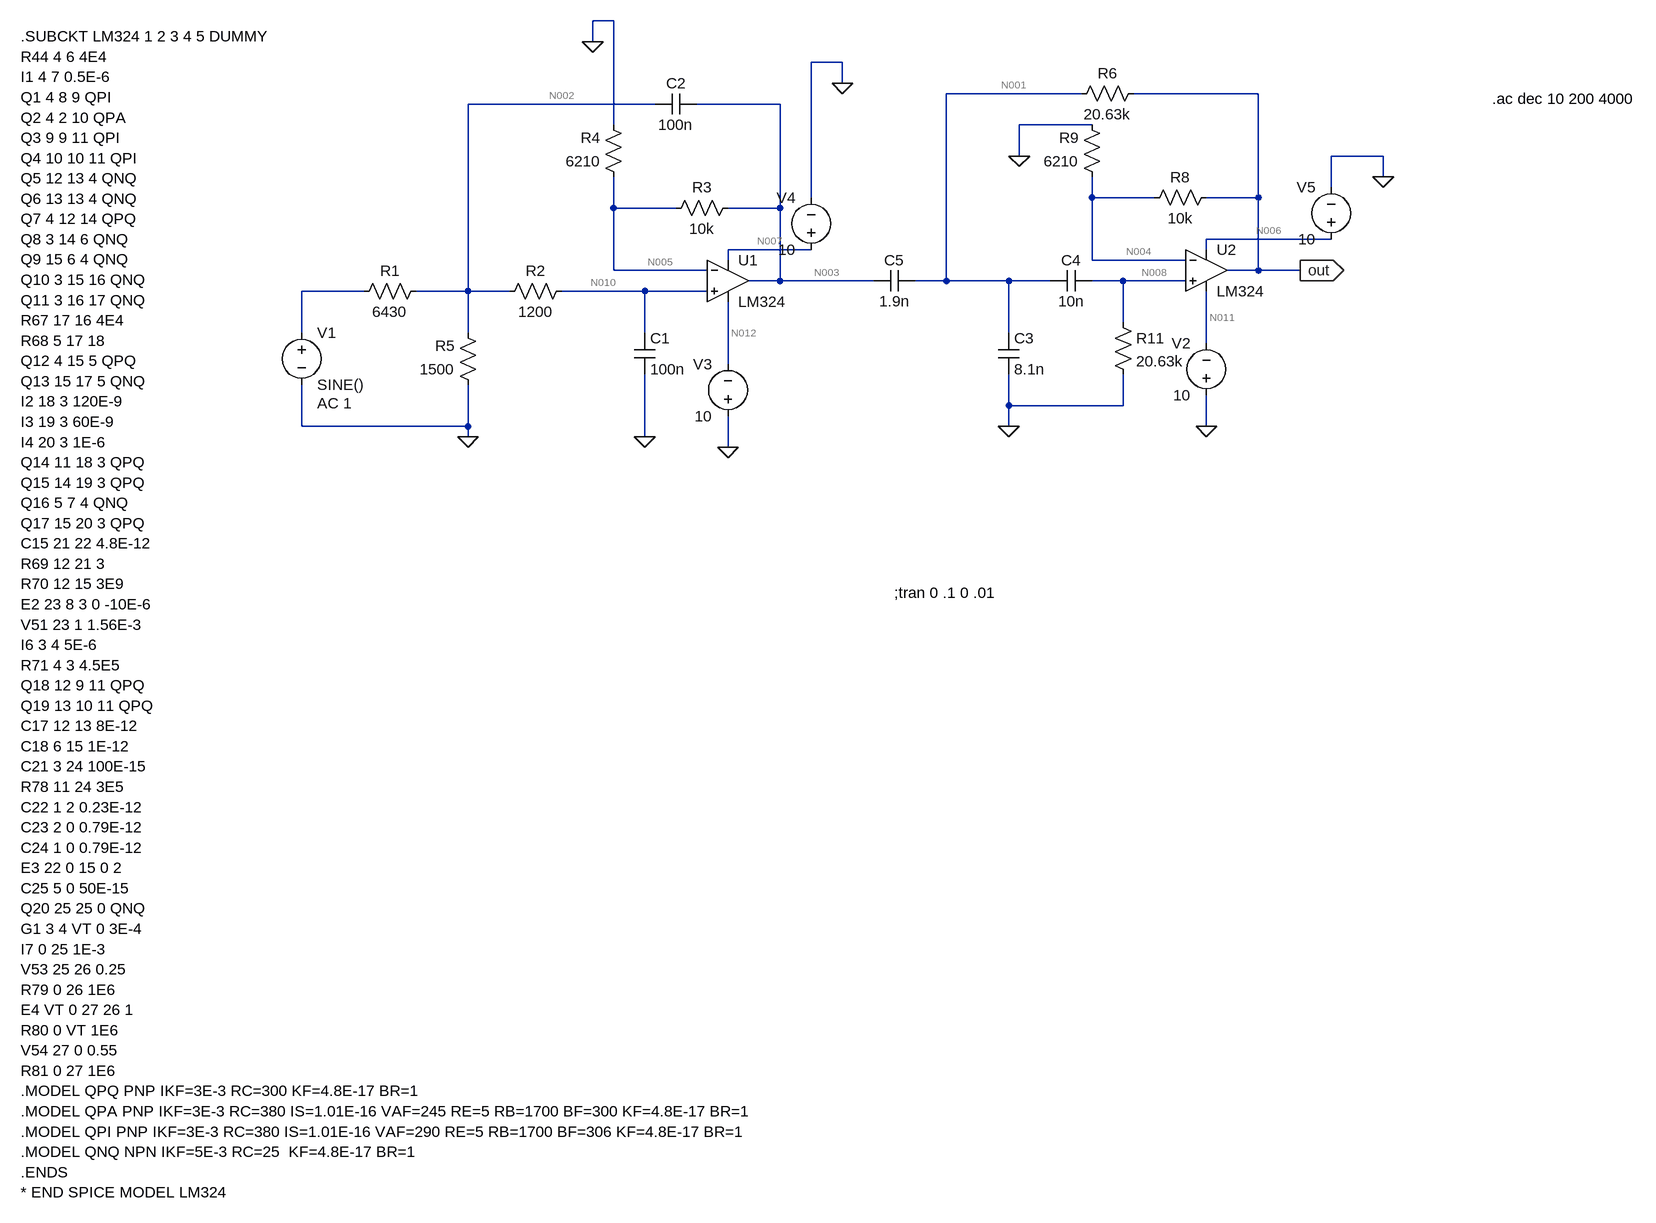
[diagram p0: schematic Draft2.asc]
Draft2.asc, the LTspice schematic file:
Version 4
SHEET 1 1476 1428
WIRE -112 -208 -144 -208
WIRE -144 -176 -144 -208
WIRE 240 -144 192 -144
WIRE 240 -112 240 -144
WIRE 608 -96 400 -96
WIRE 880 -96 688 -96
WIRE -48 -80 -336 -80
WIRE 144 -80 16 -80
WIRE -112 -48 -112 -208
WIRE 624 -48 512 -48
WIRE 512 0 512 -48
WIRE 1072 0 992 0
WIRE 1072 32 1072 0
WIRE 992 48 992 0
WIRE 192 64 192 -144
WIRE 624 64 624 32
WIRE 720 64 624 64
WIRE 880 64 880 -96
WIRE 880 64 800 64
WIRE -112 80 -112 32
WIRE -16 80 -112 80
WIRE 144 80 144 -80
WIRE 144 80 64 80
WIRE 992 128 800 128
WIRE 192 144 64 144
WIRE 800 144 800 128
WIRE 64 160 64 144
WIRE 624 160 624 64
WIRE 768 160 624 160
WIRE -112 176 -112 80
WIRE 32 176 -112 176
WIRE 880 176 880 64
WIRE 880 176 832 176
WIRE 944 176 880 176
WIRE 144 192 144 80
WIRE 144 192 96 192
WIRE 288 192 144 192
WIRE 400 192 400 -96
WIRE 400 192 352 192
WIRE 496 192 400 192
WIRE 560 192 496 192
WIRE 672 192 624 192
WIRE 768 192 672 192
WIRE -496 208 -592 208
WIRE -336 208 -336 -80
WIRE -336 208 -416 208
WIRE -272 208 -336 208
WIRE -64 208 -192 208
WIRE 32 208 -64 208
WIRE 672 256 672 192
WIRE -592 272 -592 208
WIRE -336 272 -336 208
WIRE -64 272 -64 208
WIRE 496 272 496 192
WIRE 800 288 800 208
WIRE 64 320 64 224
WIRE 496 384 496 336
WIRE 672 384 672 336
WIRE 672 384 496 384
WIRE -592 416 -592 352
WIRE -336 416 -336 352
WIRE -336 416 -592 416
WIRE 496 416 496 384
WIRE 800 416 800 368
WIRE -336 432 -336 416
WIRE -64 432 -64 336
WIRE 64 448 64 400
FLAG -336 432 0
FLAG -64 432 0
FLAG -144 -176 0
FLAG 496 416 0
FLAG 512 0 0
FLAG 944 176 out
IOPIN 944 176 Out
FLAG 800 416 0
FLAG 64 448 0
FLAG 240 -112 0
FLAG 1072 32 0
SYMBOL OpAmps\\UniversalOpAmp 64 192 R0
SYMATTR InstName U1
SYMATTR Value LM324
SYMBOL res -400 192 R90
WINDOW 0 0 56 VBottom 2
WINDOW 3 32 56 VTop 2
SYMATTR InstName R1
SYMATTR Value 6430
SYMBOL res 80 64 R90
WINDOW 0 0 56 VBottom 2
WINDOW 3 32 56 VTop 2
SYMATTR InstName R3
SYMATTR Value 10k
SYMBOL res -96 48 R180
WINDOW 0 36 76 Left 2
WINDOW 3 36 40 Left 2
SYMATTR InstName R4
SYMATTR Value 6210
SYMBOL res -320 368 R180
WINDOW 0 36 76 Left 2
WINDOW 3 36 40 Left 2
SYMATTR InstName R5
SYMATTR Value 1500
SYMBOL voltage -592 256 R0
WINDOW 123 24 124 Left 2
WINDOW 39 0 0 Left 0
SYMATTR Value2 AC 1
SYMATTR InstName V1
SYMATTR Value SINE()
SYMBOL res 816 48 R90
WINDOW 0 0 56 VBottom 2
WINDOW 3 32 56 VTop 2
SYMATTR InstName R8
SYMATTR Value 10k
SYMBOL res 640 48 R180
WINDOW 0 36 76 Left 2
WINDOW 3 36 40 Left 2
SYMATTR InstName R9
SYMATTR Value 6210
SYMBOL cap 480 272 R0
SYMATTR InstName C3
SYMATTR Value 8.1n
SYMBOL cap 624 176 R90
WINDOW 0 0 32 VBottom 2
WINDOW 3 32 32 VTop 2
SYMATTR InstName C4
SYMATTR Value 10n
SYMBOL res 656 240 R0
SYMATTR InstName R11
SYMATTR Value 20.63k
SYMBOL res 704 -112 R90
WINDOW 0 0 56 VBottom 2
WINDOW 3 32 56 VTop 2
SYMATTR InstName R6
SYMATTR Value 20.63k
SYMBOL voltage 800 384 R180
WINDOW 0 24 96 Left 2
WINDOW 3 24 16 Left 2
WINDOW 123 0 0 Left 0
WINDOW 39 0 0 Left 0
SYMATTR InstName V2
SYMATTR Value 10
SYMBOL voltage 64 416 R180
WINDOW 0 24 96 Left 2
WINDOW 3 24 16 Left 2
WINDOW 123 0 0 Left 0
WINDOW 39 0 0 Left 0
SYMATTR InstName V3
SYMATTR Value 10
SYMBOL voltage 192 160 R180
WINDOW 0 24 96 Left 2
WINDOW 3 24 16 Left 2
WINDOW 123 0 0 Left 0
WINDOW 39 0 0 Left 0
SYMATTR InstName V4
SYMATTR Value 10
SYMBOL voltage 992 144 R180
WINDOW 0 24 96 Left 2
WINDOW 3 24 16 Left 2
WINDOW 123 0 0 Left 0
WINDOW 39 0 0 Left 0
SYMATTR InstName V5
SYMATTR Value 10
SYMBOL OpAmps\\UniversalOpAmp 800 176 R0
SYMATTR InstName U2
SYMATTR Value LM324
SYMBOL cap 352 176 R90
WINDOW 0 0 32 VBottom 2
WINDOW 3 32 32 VTop 2
SYMATTR InstName C5
SYMATTR Value 1.9n
SYMBOL res -176 192 R90
WINDOW 0 0 56 VBottom 2
WINDOW 3 32 56 VTop 2
SYMATTR InstName R2
SYMATTR Value 1200
SYMBOL cap -80 272 R0
SYMATTR InstName C1
SYMATTR Value 100n
SYMBOL cap 16 -96 R90
WINDOW 0 0 32 VBottom 2
WINDOW 3 32 32 VTop 2
SYMATTR InstName C2
SYMATTR Value 100n
TEXT -1024 -184 Left 2 !.SUBCKT LM324 1 2 3 4 5 DUMMY\nR44 4 6 4E4\nI1 4 7 0.5E-6\nQ1 4 8 9 QPI\nQ2 4 2 10 QPA\nQ3 9 9 11 QPI\nQ4 10 10 11 QPI\nQ5 12 13 4 QNQ\nQ6 13 13 4 QNQ\nQ7 4 12 14 QPQ\nQ8 3 14 6 QNQ\nQ9 15 6 4 QNQ\nQ10 3 15 16 QNQ\nQ11 3 16 17 QNQ\nR67 17 16 4E4\nR68 5 17 18\nQ12 4 15 5 QPQ\nQ13 15 17 5 QNQ\nI2 18 3 120E-9\nI3 19 3 60E-9\nI4 20 3 1E-6\nQ14 11 18 3 QPQ\nQ15 14 19 3 QPQ\nQ16 5 7 4 QNQ\nQ17 15 20 3 QPQ\nC15 21 22 4.8E-12\nR69 12 21 3\nR70 12 15 3E9\nE2 23 8 3 0 -10E-6\nV51 23 1 1.56E-3\nI6 3 4 5E-6\nR71 4 3 4.5E5\nQ18 12 9 11 QPQ\nQ19 13 10 11 QPQ\nC17 12 13 8E-12\nC18 6 15 1E-12\nC21 3 24 100E-15\nR78 11 24 3E5\nC22 1 2 0.23E-12\nC23 2 0 0.79E-12\nC24 1 0 0.79E-12\nE3 22 0 15 0 2\nC25 5 0 50E-15\nQ20 25 25 0 QNQ\nG1 3 4 VT 0 3E-4\nI7 0 25 1E-3\nV53 25 26 0.25\nR79 0 26 1E6\nE4 VT 0 27 26 1\nR80 0 VT 1E6\nV54 27 0 0.55\nR81 0 27 1E6\n.MODEL QPQ PNP IKF=3E-3 RC=300 KF=4.8E-17 BR=1\n.MODEL QPA PNP IKF=3E-3 RC=380 IS=1.01E-16 VAF=245 RE=5 RB=1700 BF=300 KF=4.8E-17 BR=1\n.MODEL QPI PNP IKF=3E-3 RC=380 IS=1.01E-16 VAF=290 RE=5 RB=1700 BF=306 KF=4.8E-17 BR=1\n.MODEL QNQ NPN IKF=5E-3 RC=25  KF=4.8E-17 BR=1\n.ENDS\n* END SPICE MODEL LM324
TEXT 320 672 Left 2 !;tran 0 .1 0 .01
TEXT 1240 -88 Left 2 !.ac dec 10 200 4000

The netlist it stands for:
* Draft2.asc
XU1 N010 N005 N007 N012 N003 level1 LM324 Avol=1Meg GBW=10Meg Vos=0 En=0 Enk=0 In=0 Ink=0 Rin=500Meg  ; pins In+ In- V+ V- OUT
R1 N002 N009 6430
R3 N003 N005 10k
R4 N005 0 6210
R5 0 N002 1500
V1 N009 0 SINE() AC 1
R8 out N004 10k
R9 N004 0 6210
C3 N001 0 8.1n
C4 N008 N001 10n
R11 N008 0 20.63k
R6 out N001 20.63k
V2 0 N011 10
V3 0 N012 10
V4 N007 0 10
V5 N006 0 10
XU2 N008 N004 N006 N011 out level1 LM324 Avol=1Meg GBW=10Meg Vos=0 En=0 Enk=0 In=0 Ink=0 Rin=500Meg  ; pins In+ In- V+ V- OUT
C5 N001 N003 1.9n
R2 N010 N002 1200
C1 N010 0 100n
C2 N003 N002 100n
.SUBCKT LM324 1 2 3 4 5 DUMMY
R44 4 6 4E4
I1 4 7 0.5E-6
Q1 4 8 9 QPI
Q2 4 2 10 QPA
Q3 9 9 11 QPI
Q4 10 10 11 QPI
Q5 12 13 4 QNQ
Q6 13 13 4 QNQ
Q7 4 12 14 QPQ
Q8 3 14 6 QNQ
Q9 15 6 4 QNQ
Q10 3 15 16 QNQ
Q11 3 16 17 QNQ
R67 17 16 4E4
R68 5 17 18
Q12 4 15 5 QPQ
Q13 15 17 5 QNQ
I2 18 3 120E-9
I3 19 3 60E-9
I4 20 3 1E-6
Q14 11 18 3 QPQ
Q15 14 19 3 QPQ
Q16 5 7 4 QNQ
Q17 15 20 3 QPQ
C15 21 22 4.8E-12
R69 12 21 3
R70 12 15 3E9
E2 23 8 3 0 -10E-6
V51 23 1 1.56E-3
I6 3 4 5E-6
R71 4 3 4.5E5
Q18 12 9 11 QPQ
Q19 13 10 11 QPQ
C17 12 13 8E-12
C18 6 15 1E-12
C21 3 24 100E-15
R78 11 24 3E5
C22 1 2 0.23E-12
C23 2 0 0.79E-12
C24 1 0 0.79E-12
E3 22 0 15 0 2
C25 5 0 50E-15
Q20 25 25 0 QNQ
G1 3 4 VT 0 3E-4
I7 0 25 1E-3
V53 25 26 0.25
R79 0 26 1E6
E4 VT 0 27 26 1
R80 0 VT 1E6
V54 27 0 0.55
R81 0 27 1E6
.MODEL QPQ PNP IKF=3E-3 RC=300 KF=4.8E-17 BR=1
.MODEL QPA PNP IKF=3E-3 RC=380 IS=1.01E-16 VAF=245 RE=5 RB=1700 BF=300 KF=4.8E-17 BR=1
.MODEL QPI PNP IKF=3E-3 RC=380 IS=1.01E-16 VAF=290 RE=5 RB=1700 BF=306 KF=4.8E-17 BR=1
.MODEL QNQ NPN IKF=5E-3 RC=25  KF=4.8E-17 BR=1
.ENDS
* END SPICE MODEL LM324
;tran 0 .1 0 .01
.ac dec 10 200 4000
.lib UniversalOpAmp1.lib
.backanno
.end

* Results of the author's LTspice run, read from the files saved beside the schematic
* Operating Point, zero values left out:
*   V(n012) = -10 V
*   V(n005) = -266 µV
*   V(n007) = 10 V
*   V(n003) = -792.7 µV
*   V(n010) = 22.52 µV
*   V(n002) = 11.33 µV
*   V(out) = -349.6 µV
*   V(n004) = -96.23 µV
*   V(n001) = -349.6 µV
*   V(n008) = 192.3 µV
*   V(n011) = -10 V
*   V(n006) = 10 V
*   I(R1) = 1.763 nA
*   I(R3) = -52.67 nA
*   I(R4) = -42.83 nA
*   I(R5) = -7.556 nA
*   I(R8) = -25.34 nA
*   I(R9) = -15.5 nA
*   I(R11) = 9.319 nA
*   I(R2) = 9.319 nA
*   I(V1) = 1.763 nA
*   I(V2) = -238.7 µA
*   I(V3) = -238.7 µA
*   I(V4) = -238.6 µA
*   I(V5) = -238.7 µA
*   Ix(u1:1) = -9.319 nA
*   Ix(u1:2) = -9.84 nA
*   Ix(u1:3) = 238.6 µA
*   Ix(u1:4) = -238.7 µA
*   Ix(u1:5) = 52.67 nA
*   Ix(u2:1) = -9.319 nA
*   Ix(u2:2) = -9.84 nA
*   Ix(u2:3) = 238.7 µA
*   Ix(u2:4) = -238.7 µA
*   Ix(u2:5) = 25.34 nA
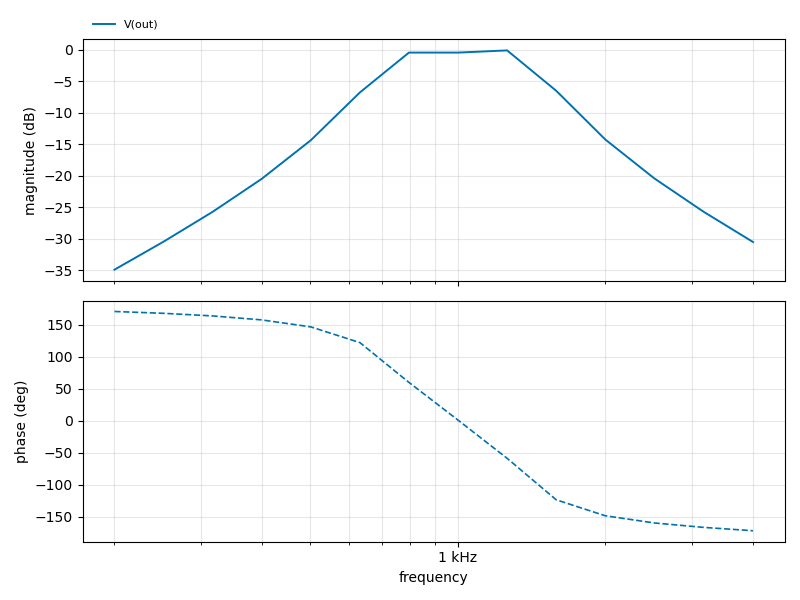
[diagram p1: AC Analysis of Draft2.asc, plotted from the saved traces]
* AC Analysis, 1 run:
*   V(out): -34.92 dB at 200 Hz, -30.53 dB at 4 kHz, peak -0.08 dB at 1.262 kHz, 3 dB below the peak at 722.7 Hz and 1.406 kHz